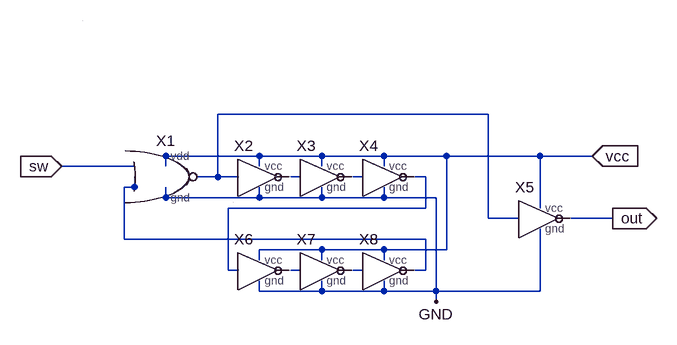
[diagram p0: schematic ring7_nor.asc]
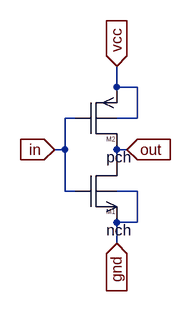
[diagram p1: sub-circuit myinv.asc]
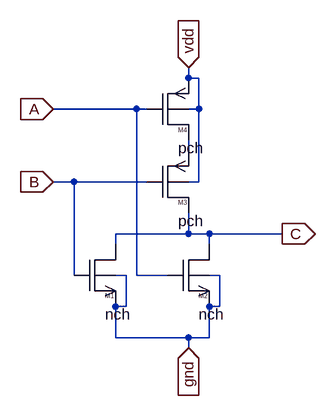
[diagram p2: sub-circuit mynor2.asc]
ring7_nor.asc, the LTspice schematic file:
Version 4
SHEET 1 920 680
WIRE 624 144 208 144
WIRE 272 208 128 208
WIRE 368 208 272 208
WIRE 464 208 368 208
WIRE 560 208 464 208
WIRE 704 208 560 208
WIRE 784 208 704 208
WIRE 80 224 -32 224
WIRE 128 224 128 208
WIRE 272 224 272 208
WIRE 368 224 368 208
WIRE 464 224 464 208
WIRE 208 240 208 144
WIRE 208 240 176 240
WIRE 240 240 208 240
WIRE 336 240 320 240
WIRE 432 240 416 240
WIRE 528 240 512 240
WIRE 80 256 80 240
WIRE 80 256 64 256
WIRE 128 272 128 256
WIRE 272 272 272 256
WIRE 272 272 128 272
WIRE 368 272 368 256
WIRE 368 272 272 272
WIRE 464 272 464 256
WIRE 464 272 368 272
WIRE 544 272 464 272
WIRE 528 288 528 240
WIRE 528 288 224 288
WIRE 704 288 704 208
WIRE 624 304 624 144
WIRE 672 304 624 304
WIRE 816 304 752 304
WIRE 64 336 64 256
WIRE 528 336 64 336
WIRE 368 352 272 352
WIRE 464 352 368 352
WIRE 560 352 560 208
WIRE 560 352 464 352
WIRE 272 368 272 352
WIRE 368 368 368 352
WIRE 464 368 464 352
WIRE 224 384 224 288
WIRE 240 384 224 384
WIRE 336 384 320 384
WIRE 432 384 416 384
WIRE 528 384 528 336
WIRE 528 384 512 384
WIRE 272 416 272 400
WIRE 368 416 368 400
WIRE 368 416 272 416
WIRE 464 416 464 400
WIRE 464 416 368 416
WIRE 544 416 544 272
WIRE 544 416 464 416
WIRE 704 416 704 320
WIRE 704 416 544 416
WIRE 544 432 544 416
WIRE 0 0 0 0
FLAG 544 432 GND
FLAG 784 208 vcc
IOPIN 784 208 In
FLAG 816 304 out
IOPIN 816 304 Out
FLAG -32 224 sw
IOPIN -32 224 In
SYMBOL myinv 272 256 R0
SYMATTR InstName X2
SYMBOL myinv 368 256 R0
SYMATTR InstName X3
SYMBOL myinv 464 256 R0
SYMATTR InstName X4
SYMBOL myinv 272 400 R0
SYMATTR InstName X6
SYMBOL myinv 368 400 R0
SYMATTR InstName X7
SYMBOL myinv 464 400 R0
SYMATTR InstName X8
SYMBOL mynor2 128 272 R0
SYMATTR InstName X1
SYMBOL myinv 704 320 R0
SYMATTR InstName X5

myinv.asc, the sub-circuit schematic file:
Version 4
SHEET 1 880 680
WIRE 176 32 176 0
WIRE 208 32 176 32
WIRE 112 80 96 80
WIRE 208 80 208 32
WIRE 208 80 176 80
WIRE 96 128 96 80
WIRE 96 128 80 128
WIRE 192 128 176 128
WIRE 176 144 176 128
WIRE 96 192 96 128
WIRE 112 192 96 192
WIRE 208 192 176 192
WIRE 208 240 208 192
WIRE 208 240 176 240
WIRE 176 272 176 240
FLAG 176 272 gnd
IOPIN 176 272 In
FLAG 176 0 vcc
IOPIN 176 0 In
FLAG 80 128 in
IOPIN 80 128 In
FLAG 192 128 out
IOPIN 192 128 In
SYMBOL nmos4 112 192 R0
WINDOW 3 48 60 Left 2
SYMATTR InstName M1
SYMATTR Value nch
SYMATTR Value2 l=2u w=6u
SYMBOL pmos4 112 80 R0
WINDOW 3 48 60 Left 2
SYMATTR InstName M2
SYMATTR Value pch
SYMATTR Value2 l=2u w=18u

mynor2.asc, the sub-circuit schematic file:
Version 4
SHEET 1 880 680
WIRE 240 -32 240 -48
WIRE 256 -32 240 -32
WIRE 160 16 32 16
WIRE 176 16 160 16
WIRE 256 16 256 -32
WIRE 256 16 240 16
WIRE 240 80 240 64
WIRE 64 128 32 128
WIRE 176 128 64 128
WIRE 256 128 256 16
WIRE 256 128 240 128
WIRE 240 208 240 176
WIRE 240 208 128 208
WIRE 272 208 240 208
WIRE 384 208 272 208
WIRE 128 224 128 208
WIRE 272 224 272 208
WIRE 64 272 64 128
WIRE 144 272 128 272
WIRE 160 272 160 16
WIRE 208 272 160 272
WIRE 288 272 272 272
WIRE 144 320 144 272
WIRE 144 320 128 320
WIRE 288 320 288 272
WIRE 288 320 272 320
WIRE 128 368 128 320
WIRE 240 368 128 368
WIRE 272 368 272 320
WIRE 272 368 240 368
WIRE 240 384 240 368
FLAG 32 16 A
IOPIN 32 16 In
FLAG 32 128 B
IOPIN 32 128 In
FLAG 384 208 C
IOPIN 384 208 Out
FLAG 240 -48 vdd
IOPIN 240 -48 In
FLAG 240 384 gnd
IOPIN 240 384 In
SYMBOL nmos4 64 272 R0
WINDOW 3 48 60 Left 2
SYMATTR InstName M1
SYMATTR Value nch
SYMATTR Value2 l=2u w=6u
SYMBOL nmos4 208 272 R0
WINDOW 3 48 60 Left 2
SYMATTR InstName M2
SYMATTR Value nch
SYMATTR Value2 l=2u w=6u
SYMBOL pmos4 176 128 R0
WINDOW 3 48 60 Left 2
SYMATTR InstName M3
SYMATTR Value pch
SYMATTR Value2 l=2u w=18u
SYMBOL pmos4 176 16 R0
WINDOW 3 48 60 Left 2
SYMATTR InstName M4
SYMATTR Value pch
SYMATTR Value2 l=2u w=18u

The netlist it stands for:
* ring7_nor.asc
XX2 GND N001 N002 vcc myinv
XX3 GND N002 N003 vcc myinv
XX4 GND N003 N004 vcc myinv
XX6 GND N004 N006 vcc myinv
XX7 GND N006 N007 vcc myinv
XX8 GND N007 N005 vcc myinv
XX1 sw N005 GND vcc N001 mynor2
XX5 GND N001 out vcc myinv

* block symbol definitions
.subckt myinv gnd in out vcc
M1 out in gnd gnd nch l=2u w=6u
M2 out in vcc vcc pch l=2u w=18u
.ends myinv

.subckt mynor2 A B gnd vdd C
M1 C B gnd gnd nch l=2u w=6u
M2 C A gnd gnd nch l=2u w=6u
M3 C B N001 vdd pch l=2u w=18u
M4 N001 A vdd vdd pch l=2u w=18u
.ends mynor2

.model NMOS NMOS
.model PMOS PMOS
.lib standard.mos
.backanno
.end